# Altium schematic sheet RS232-U5_U6.SchDoc
size A3
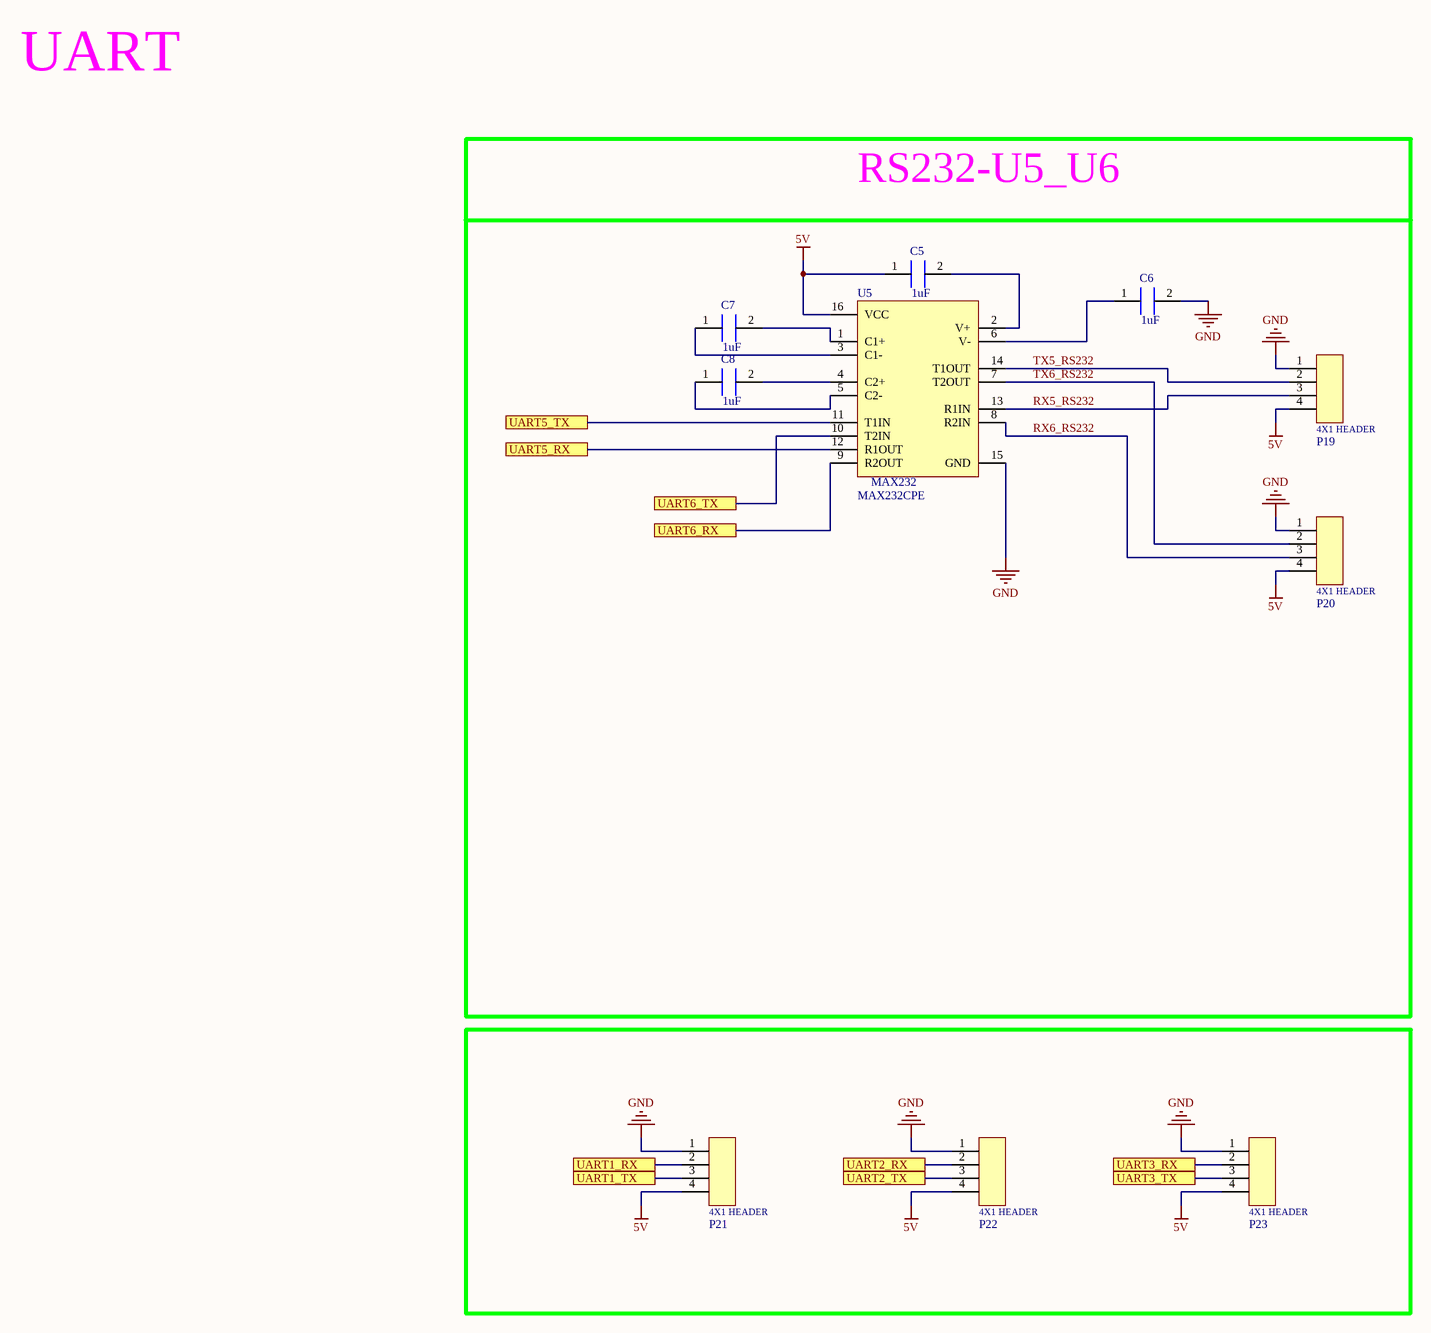
[diagram p0: RS232-U5_U6.SchDoc]

## Parts
C5  CAP CER 1UF 25V X7R 0805  [C0805C105J3RAC7800]  (value not drawn)
C6  CAP CER 1UF 25V X7R 0805  [C0805C105J3RAC7800]  (value not drawn)
C7  CAP CER 1UF 25V X7R 0805  [C0805C105J3RAC7800]  (value not drawn)
C8  CAP CER 1UF 25V X7R 0805  [C0805C105J3RAC7800]  (value not drawn)
P19  WIRE-TO BOARD HEADER, 2.5MM, 4 C  [51125-04-0200-01]  (value not drawn)
P20  WIRE-TO BOARD HEADER, 2.5MM, 4 C  [51125-04-0200-01]  (value not drawn)
P21  WIRE-TO BOARD HEADER, 2.5MM, 4 C  [51125-04-0200-01]  (value not drawn)
P22  WIRE-TO BOARD HEADER, 2.5MM, 4 C  [51125-04-0200-01]  (value not drawn)
P23  WIRE-TO BOARD HEADER, 2.5MM, 4 C  [51125-04-0200-01]  (value not drawn)
U5  MAX232CPE  [MAX232CPE]

## Blocks framed on the sheet
RS232-U5_U6: C5-C8 P19 P20 U5

## Ports
UART1_RX, UART1_TX, UART2_RX, UART2_TX, UART3_RX, UART3_TX, UART5_RX, UART5_TX, UART6_RX, UART6_TX

## Nets
5V: C5.1 P19.4 P20.4 P21.4 P22.4 P23.4 U5.16(VCC)
GND: C6.2 P19.1 P20.1 P21.1 P22.1 P23.1 U5.15(GND)
RX5_RS232: P19.3 U5.13(R1IN)
RX6_RS232: P20.3 U5.8(R2IN)
TX5_RS232: P19.2 U5.14(T1OUT)
TX6_RS232: P20.2 U5.7(T2OUT)
UART1_RX: P21.2 ; port UART1_RX
UART1_TX: P21.3 ; port UART1_TX
UART2_RX: P22.2 ; port UART2_RX
UART2_TX: P22.3 ; port UART2_TX
UART3_RX: P23.2 ; port UART3_RX
UART3_TX: P23.3 ; port UART3_TX
UART5_RX: U5.12(R1OUT) ; port UART5_RX
UART5_TX: U5.11(T1IN) ; port UART5_TX
UART6_RX: U5.9(R2OUT) ; port UART6_RX
UART6_TX: U5.10(T2IN) ; port UART6_TX
NetC5_2: C5.2 U5.2(V+)
NetC6_1: C6.1 U5.6(V-)
NetC7_1: C7.1 U5.3(C1-)
NetC7_2: C7.2 U5.1(C1+)
NetC8_1: C8.1 U5.5(C2-)
NetC8_2: C8.2 U5.4(C2+)

## Notes on the sheet
- UART
- (in symbol 51125-04-0200-01) 4X1 HEADER

## Library data of the parts
C5-C8 = C0805C105J3RAC7800: Cap Ceramic 1uF 25V X7R 5% SMD 0805 125C Plastic T/R; Manufacturer: KEMET; Manufacturer Part Number: C0805C105J3RACTU; Supplier 1: Farnell; RoHS: Yes; Category: Ceramic Capacitors; Stock 1: 72500; Pricing 1: 2500=0,29500 (EUR); Mount: Surface Mount; Case/Package: 0805; Case Code (Metric): 2012; Case Code (Imperial): 0805; Dielectric Material: Ceramic; Min Operating Temperature: -55°C; Max Operating Temperature: 125°C; Package Quantity: 1; Capacitance: 1uF; Voltage Rating: 25V; Tolerance: 5%; Packaging: Tape and Reel; Voltage Rating (DC): 25V; Dielectric: X7R; Termination: SMD/SMT; Series: C; Length: 2mm; Width: 0.049inch; Thickness: 0.055inch; Depth: 1.25mm; Radiation Hardening: No; REACH SVHC: No SVHC; RoHS Compliant: Yes; ComponentLink1URL: http://components.arrow.com/part/dataview/46126037S66869N7429?src-supplier=Arrow+Electronics; ComponentLink1Description: http://components.arrow.com/part/dataview/46126037S66869N7429?src-supplier=Arrow+Electronics; ComponentLink2URL: http://www.farnell.com/datasheets/2745929.pdf?src-supplier=Farnell; ComponentLink2Description: http://www.farnell.com/datasheets/2745929.pdf?src-supplier=Farnell; ComponentLink3URL: http://www.mouser.com/ds/2/212/KEM_C1002_X7R_SMD-1102033.pdf?src-supplier=Mouser; ComponentLink3Description: http://www.mouser.com/ds/2/212/KEM_C1002_X7R_SMD-1102033.pdf?src-supplier=Mouser; ComponentLink4URL: http://components.arrow.com/part/dataview/0323_00011351?src-supplier=Arrow+Europe; ComponentLink4Description: http://components.arrow.com/part/dataview/0323_00011351?src-supplier=Arrow+Europe; ComponentLink5URL: https://api.kemet.com/component-edge/download/datasheet/C0805C105J3RACTU.pdf?src-supplier=Digi-Key; ComponentLink5Description: https://api.kemet.com/component-edge/download/datasheet/C0805C105J3RACTU.pdf?src-supplier=Digi-Key; ComponentLink6URL: http://www.farnell.com/datasheets/2745929.pdf?src-supplier=Newark; ComponentLink6Description: http://www.farnell.com/datasheets/2745929.pdf?src-supplier=Newark; ComponentLink7URL: http://www.farnell.com/datasheets/2745929.pdf?src-supplier=Element14; ComponentLink7Description: http://www.farnell.com/datasheets/2745929.pdf?src-supplier=Element14
P19-P23 = 51125-04-0200-01: Manufacturer: CNC Tech; Supplier 1: Digi-Key; Manufacturer Part Number: 51125-04-0200-01; RoHS: No; Category: Connectors; Stock 1: 5369; Pricing 1: 1=0,21000, 10=0,17700, 100=0,13650, 500=0,11550, 1000=0,09450, 5000=0,08400, 10000=0,07613 (USD); Supplier Part Number 1: 1175-51125-04-0200-01-ND
U5 = MAX232CPE: MAX232 Series 120 kbps 5.5 V Through Hole RS-232 Transceiver - PDIP-16; Manufacturer: Maxim; Manufacturer Part Number: MAX232CPE+; Propagation Delay: 10us; Number of Transmitters: 2; Operating Supply Voltage: 5V; Min Supply Voltage: 4.5V; Max Supply Voltage: 5.5V; Operating Supply Current: 10mA; Number of Transceivers: 1; Supply Type: Single; Supplier 1: Farnell; RoHS: Yes; Category: RS-232 / RS-422 / RS-485 Interface ICs; Stock 1: 9660; Pricing 1: 1=4,80000, 10=3,86000, 25=3,63000, 50=3,48000, 100=3,32000, 250=3,29000, 500=3,24000 (EUR); Mount: Through Hole; Case/Package: PDIP; Number of Pins: 16; Weight: 0.056438oz; Contact Plating: Tin,Matte; Min Operating Temperature: 0°C; Max Operating Temperature: 70°C; Packaging: Rail/Tube; Package Quantity: 25; Number of Receivers: 2; Data Rate: 120Kbps; Interface: RS-232; Logic Function: Transceiver; Number of Drivers: 2; Type: Integrated Circuit (IC); Series: MAX232; Length: 19.43mm; Width: 7.87mm; Height: 4.45mm; Radiation Hardening: No; REACH SVHC: No SVHC; Lead Free: Lead Free; RoHS Compliant: Yes; ComponentLink1URL: https://datasheet.ciiva.com/22828/0900766b807c18c1-22828294.pdf?src-supplier=RSComponents; ComponentLink1Description: https://datasheet.ciiva.com/22828/0900766b807c18c1-22828294.pdf?src-supplier=RSComponents; ComponentLink2URL: https://datasheet.ciiva.com/29306/170049-da-01-en-ic-max232cpe-dip16-29306280.pdf?src-supplier=Conrad; ComponentLink2Description: https://datasheet.ciiva.com/29306/170049-da-01-en-ic-max232cpe-dip16-29306280.pdf?src-supplier=Conrad; ComponentLink3URL: https://datasheet.ciiva.com/26833/max232cpe-26833420.pdf?src-supplier=IIIC; ComponentLink3Description: https://datasheet.ciiva.com/26833/max232cpe-26833420.pdf?src-supplier=IIIC; ComponentLink4URL: https://datasheet.ciiva.com/26833/max232cpe-26833436.pdf?src-supplier=IIIC; ComponentLink4Description: https://datasheet.ciiva.com/26833/max232cpe-26833436.pdf?src-supplier=IIIC; ComponentLink5URL: https://datasheet.ciiva.com/18410/70157118-18410440.pdf?src-supplier=Allied+Electronics; ComponentLink5Description: https://datasheet.ciiva.com/18410/70157118-18410440.pdf?src-supplier=Allied+Electronics; ComponentLink6URL: https://datasheet.ciiva.com/3028/max220-max249-3028373.pdf?src-supplier=Avnet; ComponentLink6Description: https://datasheet.ciiva.com/3028/max220-max249-3028373.pdf?src-supplier=Avnet